# EAGLE design stepper-tester (EAGLE 5.12)
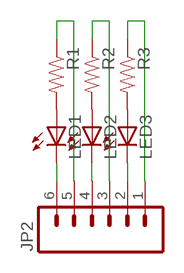
[diagram p0: schematic, sheet 1]

## Parts
JP2  M06SIP  [1X06]
LED1  LED0805  [0805-LED]
LED2  LED0805  [0805-LED]
LED3  LED0805  [0805-LED]
R1  RESISTOR0805  [0805-RC]
R2  RESISTOR0805  [0805-RC]
R3  RESISTOR0805  [0805-RC]

## Nets
N$1: LED2.A R2.2
N$2: LED3.A R3.2
N$3: LED1.A R1.2
N$4: JP2.6 LED1.C
N$5: JP2.5 R1.1
N$6: JP2.4 LED2.C
N$7: JP2.3 R2.1
N$8: JP2.2 LED3.C
N$9: JP2.1 R3.1

## Library data of the parts
JP2 = SparkFun:M06: Header 6 Standard 6-pin 0.1" header. Use with straight break away headers (SKU : PRT-00116), right angle break away headers (PRT-00553), swiss pins (PRT-00743), machine pins (PRT-00117), and female headers (PRT-00115). Molex polarized connector foot print use with SKU : PRT-08094 with associated crimp pins and housings. NOTES ON THE VARIANTS LOCK and LOCK_LONGPADS... This footprint was designed to help hold the alignment of a through-hole component (i.e. 6-pin header) while soldering it into place. You may notice that each hole has been shifted either up or down by 0.005 of an inch from it's more standard position (which is a perfectly straight line). This slight alteration caused the pins (the squares in the middle) to touch the edges of the holes. Because they are alternating, it causes a "brace" to hold the component in place. 0.005 has proven to be the perfect amount of "off-center" position when using our standard breakaway headers. Although looks a little odd when you look at the bare footprint, once you have a header in there, the alteration is very hard to notice. Also, if you push a header all the way into place, it is covered up entirely on the bottom side. This idea of altering the position of holes to aid alignment will be further integrated into the Sparkfun Library for other footprints. It can help hold any component with 3 or more connection pins.
LED1-LED3 = Hoektronics:LED: LEDs Standard schematic elements and footprints for 5mm, 3mm, 1206, and 0603 sized LEDs. 5mm - Spark Fun Electronics SKU : COM-00529 (and others)
R1-R3 = Hoektronics:RESISTOR: Resistor Basic schematic elements and footprints for 0603, 1206, and PTH 1/10th watt (small) resistors.

## Board
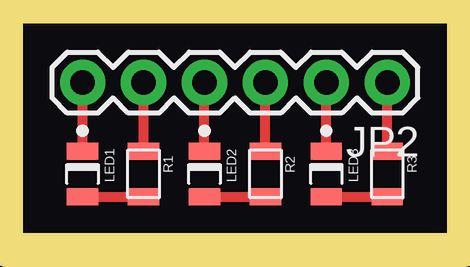
[diagram p1: board, top side]

No outline drawn. Coordinates in mm, seen from the top.
Copper layers (1*16): Top 0.035mm / dielectric 1.5mm / Bottom 0.035mm
Design rules "default": minimum track width 10mil, minimum drill 24mil, track to track 8mil, track to pad 8mil, pad to pad 8mil, via to via 8mil, smd to smd 8mil, copper to edge 40mil, drill to drill 8mil, minimum pad ring 10mil, minimum via ring 8mil, stop-mask expansion 4mil, vias tented up to drill 0mil, thermal gap 10mil
Milling: 4 lines

### Footprints (pad centres in the part's own frame; a part is rotated, then mirrored left to right if it is on the bottom)
1X06 = drill 1.016 pad 1.88 round: 1 0,0; 2 2.54,0; 3 5.08,0; 4 7.62,0; 5 10.16,0; 6 12.7,0
0805-LED = smd 0.7 x 1.3: A 0.95,0; C -0.95,0
0805-RC = smd 0.7 x 1.3: 1 -0.95,0; 2 0.95,0

### Placement (x,y rotation side)
JP2  16.51,7.62 180 top
LED1  3.81,3.81 270 top
LED2  8.89,3.81 270 top
LED3  13.97,3.81 270 top
R1  6.35,3.81 270 top
R2  11.43,3.81 270 top
R3  16.51,3.81 270 top

### Tracks (layer width: path | path; a pad name or v marks a point on that pad's centre or on a via)
N$1
  Top 0.406: LED2.A R2.2
N$2
  Top 0.406: LED3.A R3.2
N$3
  Top 0.406: LED1.A R1.2
N$4
  Top 0.406: LED1.C JP2.6
N$5
  Top 0.406: R1.1 JP2.5
N$6
  Top 0.406: LED2.C JP2.4
N$7
  Top 0.406: R2.1 JP2.3
N$8
  Top 0.406: LED3.C JP2.2
N$9
  Top 0.406: R3.1 JP2.1